# Altium schematic sheet PowerSupply.SchDoc
size 420 x 297 mm; SheetNumber: 4; SheetTotal: 6
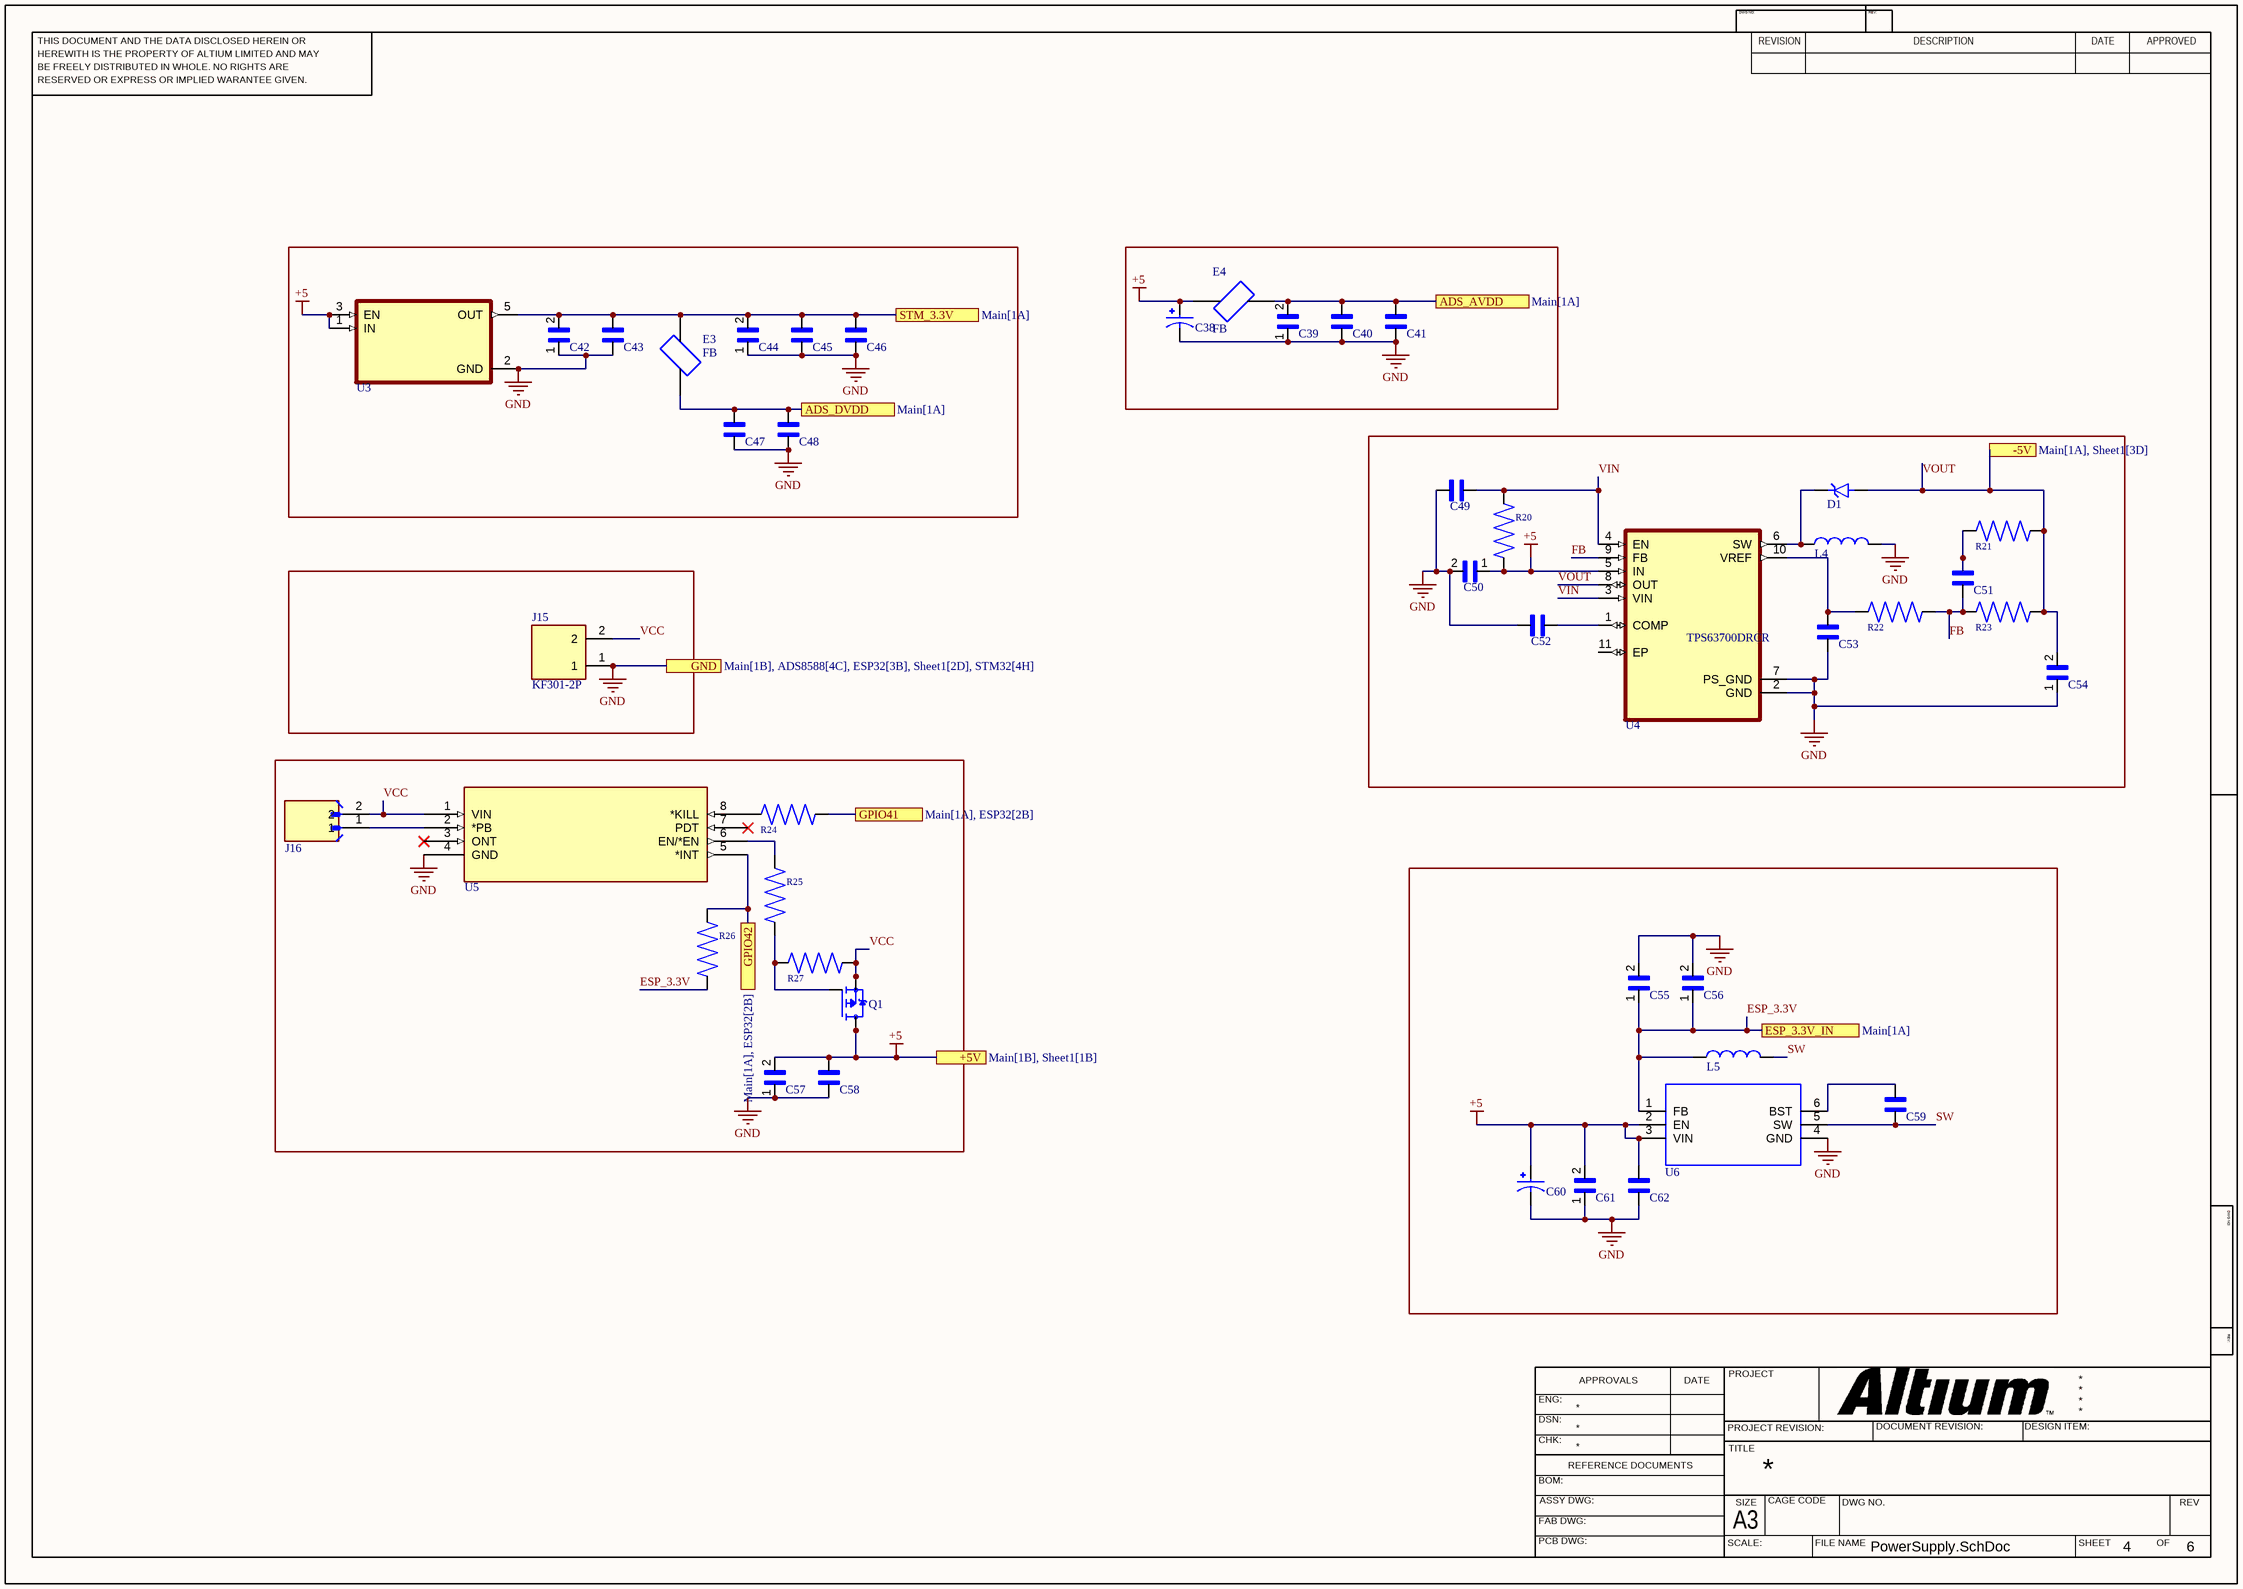
[diagram p0: PowerSupply.SchDoc]

## Parts
C38  100 uF  [100 uF]  (value not drawn)
C39  C2012X7R1H104K085AA  [CAPC2012X100N]  (value not drawn)
C40  CAP603  [CAP603]  (value not drawn)
C41  CAP603  [CAP603]  (value not drawn)
C42  C2012X7R1H104K085AA  [CAPC2012X100N]  (value not drawn)
C43  CAP603  [CAP603]  (value not drawn)
C44  C2012X7R1H104K085AA  [CAPC2012X100N]  (value not drawn)
C45  CAP603  [CAP603]  (value not drawn)
C46  CAP603  [CAP603]  (value not drawn)
C47  CAP603  [CAP603]  (value not drawn)
C48  CAP603  [CAP603]  (value not drawn)
C49  CAP603  [CAP603]  (value not drawn)
C50  C2012X7R1H104K085AA  [CAPC2012X100N]  (value not drawn)
C51  CAP603  [CAP603]  (value not drawn)
C52  CAP603  [CAP603]  (value not drawn)
C53  CAP603  [CAP603]  (value not drawn)
C54  C2012X7R1H104K085AA  [CAPC2012X100N]  (value not drawn)
C55  C2012X7R1H104K085AA  [CAPC2012X100N]  (value not drawn)
C56  C2012X7R1H104K085AA  [CAPC2012X100N]  (value not drawn)
C57  C2012X7R1H104K085AA  [CAPC2012X100N]  (value not drawn)
C58  CAP603  [CAP603]  (value not drawn)
C59  CAP603  [CAP603]  (value not drawn)
C60  100 uF  [100 uF]  (value not drawn)
C61  C2012X7R1H104K085AA  [CAPC2012X100N]  (value not drawn)
C62  CAP603  [CAP603]  (value not drawn)
D1  zenor diode  [zenor diode]  (value not drawn)
E3  FB  [FB_MI1206K601R-10]
E4  FB  [FB_MI1206K601R-10]
J15  KF301-2P  [HANDSON_KF301-2P]
J16  2-pin jst  [2-pin jst]  (value not drawn)
L4  inductor  [inductor]  (value not drawn)
L5  inductor  [inductor]  (value not drawn)
Q1  AO4407A  [AO4407A]  (value not drawn)
R20  RES-603  [CAP603]  (value not drawn)
R21  RES-603  [CAP603]  (value not drawn)
R22  RES-603  [CAP603]  (value not drawn)
R23  RES-603  [CAP603]  (value not drawn)
R24  RES-603  [CAP603]  (value not drawn)
R25  RES-603  [CAP603]  (value not drawn)
R26  RES-603  [CAP603]  (value not drawn)
R27  RES-603  [CAP603]  (value not drawn)
U3  TLV75533PDBVR  [TLV75533PDBVR]  (value not drawn)
U4  TPS63700DRCR  [TPS63700DRCR]
U5  LTC2954CTS8-1#TRMPBF  [LTC2954CTS8-1#TRMPBF]  (value not drawn)
U6  AP63203WU-7  [AP63203WU-7]  (value not drawn)

## Ports
+5V (see Main[1B], Sheet1[1B]), -5V (see Main[1A], Sheet1[3D]), ADS_AVDD (see Main[1A]), ADS_DVDD (see Main[1A]), ESP_3.3V_IN (see Main[1A]), GND (see Main[1B], ADS8588[4C], ESP32[3B], Sheet1[2D], STM32[4H]), GPIO41 (see Main[1A], ESP32[2B]), GPIO42 (see Main[1A], ESP32[2B]), STM_3.3V (see Main[1A])

## Nets
+5: C38.1 C50.1 C57.2 C58.2 C60.1 C61.2 C62.2 E4.2 Q1.5(D) Q1.6(D) Q1.7(D) Q1.8(D) R20.1 U3.1(IN) U3.3(EN) U4.5(IN) U6.2(EN) U6.3(VIN) ; port +5V
GND: C38.2 C39.1 C40.1 C41.1 C42.1 C43.1 C44.1 C45.1 C46.1 C47.1 C48.1 C49.2 C50.2 C52.2 C53.1 C54.1 C55.2 C56.2 C57.1 C58.1 C60.2 C61.1 C62.1 J15.1 L4.2 U3.2(GND) U4.2(GND) U4.7(PS_GND) U5.4(GND) U6.4(GND) ; port GND
ADS_AVDD: C39.2 C40.2 C41.2 E4.1 ; port ADS_AVDD
ADS_DVDD: C47.2 C48.2 E3.1 ; port ADS_DVDD
ESP_3.3V: C55.1 C56.1 L5.1 R26.1 U6.1(FB) ; port ESP_3.3V_IN
FB: C51.1 R22.2 R23.1 U4.9(FB)
GPIO41: R24.2 ; port GPIO41
GPIO42: R26.2 U5.5(*INT) ; port GPIO42
STM_3.3V: C42.2 C43.2 C44.2 C45.2 C46.2 E3.2 U3.5(OUT) ; port STM_3.3V
SW: C59.1 L5.2 U6.5(SW)
VCC: J15.2 J16.2 Q1.1(S) Q1.2(S) Q1.3(S) R27.2 U5.1(VIN)
VIN: C49.1 R20.2 U4.3(VIN) U4.4(EN)
VOUT: C54.2 D1.A R21.2 R23.2 U4.8(OUT) ; port -5V
NetC51_2: C51.2 R21.1
NetC52_1: C52.1 U4.1(COMP)
NetC53_2: C53.2 R22.1 U4.10(VREF)
NetC59_2: C59.2 U6.6(BST)
NetD1_C: D1.C(K) L4.1 U4.6(SW)
NetJ16_1: J16.1 U5.2(*PB)
NetQ1_4: Q1.4(G) R25.2 R27.1
NetR24_1: R24.1 U5.8(*KILL)
NetR25_1: R25.1 U5.6(EN/*EN)

Not connected (* = marked no-connect by the designer): U4 11(EP); U5 3(ONT)* 7(PDT)*

## Notes on the sheet
- THIS DOCUMENT AND THE DATA DISCLOSED HEREIN OR
- HEREWITH IS THE PROPERTY OF ALTIUM LIMITED AND MAY
- DWG NO:
- REVISION
- REV:
- DESCRIPTION
- DATE
- APPROVED
- BE FREELY DISTRIBUTED IN WHOLE. NO RIGHTS ARE
- RESERVED OR EXPRESS OR IMPLIED WARANTEE GIVEN.
- ENG:
- APPROVALS
- PROJECT
- DSN:
- CHK:
- REFERENCE DOCUMENTS
- PROJECT REVISION:
- TITLE
- DOCUMENT REVISION:
- DESIGN ITEM:
- BOM:
- FAB DWG:
- PCB DWG:
- ASSY DWG:
- SCALE:
- A3
- SIZE
- CAGE CODE
- FILE NAME
- DWG NO.
- SHEET
- OF
- REV

## Library data of the parts
C38 C60 = 100 uF: Capacitor, Polymer Aluminum, Radial, 12mOhm, 100 CAP, 16V, SVPG, Surface Mount | Panasonic Electronic Components 16SVPG100M; SnapEDA_Link: https://www.snapeda.com/parts/16SVPG100M/Panasonic/view-part/?ref=snap; Package: None; Value: *; MF: Panasonic; MP: 16SVPG100M; Check_prices: https://www.snapeda.com/parts/16SVPG100M/Panasonic/view-part/?ref=eda
C39 C42 C44 C50 C54-C57 C61 = C2012X7R1H104K085AA: 0.1 ÂµF Â±10% 50V Ceramic Capacitor X7R 0805 (2012 Metric); MF: TDK; Purchase-URL: https://pricing.snapeda.com/search/part/C2012X7R1H104K085AA/?ref=eda; Package: 2012 TDK; MP: C2012X7R1H104K085AA; Value: *; SnapEDA_Link: https://www.snapeda.com/parts/C2012X7R1H104K085AA/TDK/view-part/?ref=snap; Digi-Key_Part_Number: 445-7534-1-ND; Check_prices: https://www.snapeda.com/parts/C2012X7R1H104K085AA/TDK/view-part/?ref=eda
C40 C41 C43 C45-C49 C51-C53 C58 C59 C62 = CAP603: 0.1 ÂµF Â±5% 10V Ceramic Capacitor X7R 0603 (1608 Metric); MF: Vishay; MP: VJ0603Y104JXQCW1BC; SnapEDA_Link: https://www.snapeda.com/parts/VJ0603Y104JXQCW1BC/Vishay/view-part/?ref=snap; Package: 0603-2 VISHAY; Value: *; Check_prices: https://www.snapeda.com/parts/VJ0603Y104JXQCW1BC/Vishay/view-part/?ref=eda
D1 = zenor diode: DO-214AC (SMA), 1250mW, 5%, Zener Diode; MF: Taiwan Semiconductor; MP: 1SMA4746H; SnapEDA_Link: https://www.snapeda.com/parts/1SMA4746H/taiwan/view-part/?ref=snap; Package: SMA-2 Taiwan Semiconductor; Value: *; Check_prices: https://www.snapeda.com/parts/1SMA4746H/taiwan/view-part/?ref=eda
E3 E4 = MI1206K601R-10: 600 Ohms @ 100 MHz 1 Power, Signal Line Ferrite Bead 1206 (3216 Metric) 1.5A 80mOhm; MF: Laird-Signal Integrity; SnapEDA_Link: https://www.snapeda.com/parts/MI1206K601R-10/Laird-Signal+Integrity+Products/view-part/?ref=snap; Package: 1206 Laird; Value: *; MP: MI1206K601R-10; Check_prices: https://www.snapeda.com/parts/MI1206K601R-10/Laird-Signal+Integrity+Products/view-part/?ref=eda
J15 = KF301-2P: 2 Pin Terminal Block 5mm Pitch; MF: Handson Technology; SnapEDA_Link: https://www.snapeda.com/parts/KF301-2P/Handson+Technology/view-part/?ref=snap; Package: None; Value: *; MP: KF301-2P; Check_prices: https://www.snapeda.com/parts/KF301-2P/Handson+Technology/view-part/?ref=eda
J16 = 2-pin jst: Connector Header Through Hole 2 position 0.079 (2.00mm); MF: JST Sales America Inc.; MP: B2B-PH-K-S; SnapEDA_Link: https://www.snapeda.com/parts/B2B-PH-K-S/JST/view-part/?ref=snap; Package: None; Value: *; Check_prices: https://www.snapeda.com/parts/B2B-PH-K-S/JST/view-part/?ref=eda
L4 L5 = inductor: Inductor with Inductance: 4.7uH Tol. +/-20%, Package: 0603 _1608_; MF: Murata Electronics; MP: LQM18PN4R7MFRL; SnapEDA_Link: https://www.snapeda.com/parts/LQM18PN4R7MFRL/Murata%20Electronics%20North%20America/view-part/1499515/?ref=snap; Availability: Unavailable; Value: *; Price: None; Package: 1608 Murata
Q1 = AO4407A: P-Channel 30 V 12A (Ta) 3.1W (Ta) Surface Mount 8-SOIC; MF: Alpha &; SnapEDA_Link: https://www.snapeda.com/parts/AO4407A/Alpha/view-part/?ref=snap; Package: SOIC-8 Alpha &amp; Omega Semiconductor; Value: *; MP: AO4407A; Check_prices: https://www.snapeda.com/parts/AO4407A/Alpha/view-part/?ref=eda
R20-R27 = RES-603: MF: Yageo; MP: RC0805FR-0710KL; Value: *; SnapEDA_Link: https://www.snapeda.com/parts/RC0805FR-0710KL/Yageo/view-part/?ref=snap; Purchase-URL: https://pricing.snapeda.com/search/part/RC0805FR-0710KL/?ref=eda; Availability: In Stock; Price: None; Package: 2012 Rohm Semiconductor; Check_prices: https://www.snapeda.com/parts/RC0805FR-0710KL/Yageo/view-part/?ref=eda
U3 = TLV75533PDBVR: 500-mA High-PSRR Low-IQ-Tief-Dropout-Spannungsregler mitablem; MF: Texas Instruments; SnapEDA_Link: https://www.snapeda.com/parts/TLV75533PDBVR/Texas+Instruments/view-part/?ref=snap; Package: SOT-23-5 Texas Instruments; Value: *; MP: TLV75533PDBVR; Check_prices: https://www.snapeda.com/parts/TLV75533PDBVR/Texas+Instruments/view-part/?ref=eda
U4 = TPS63700DRCR: Adjustable, -15V Output Inverting DC/DC Converter in 3x3 QFN; MF: Texas Instruments; SnapEDA_Link: https://www.snapeda.com/parts/TPS63700DRCR/Texas+Instruments/view-part/?ref=snap; Package: VSON-10 Texas Instruments; Value: *; MP: TPS63700DRCR; Check_prices: https://www.snapeda.com/parts/TPS63700DRCR/Texas+Instruments/view-part/?ref=eda
U5 = LTC2954CTS8-1#TRMPBF: MF: {'manufacturer': u'Analog Devices Inc.'}; Package: None; Price: None; Value: *; MP: LTC2954CTS8-1#TRMPBF; Availability: Unavailable
U6 = AP63203WU-7: Buck Switching Regulator IC Positive Fixed 3.3V 1 Output 2A SOT-23-6 Thin, TSOT-23-6; MF: Diodes Zetex; SnapEDA_Link: https://www.snapeda.com/parts/AP63203WU-7/Diodes+Inc./view-part/?ref=snap; Package: SOT-23-6 Diodes Incorporated; Value: *; MP: AP63203WU-7; Check_prices: https://www.snapeda.com/parts/AP63203WU-7/Diodes+Inc./view-part/?ref=eda